# Altium schematic sheet LMD18200直流电机驱动器.SchDoc
size A4
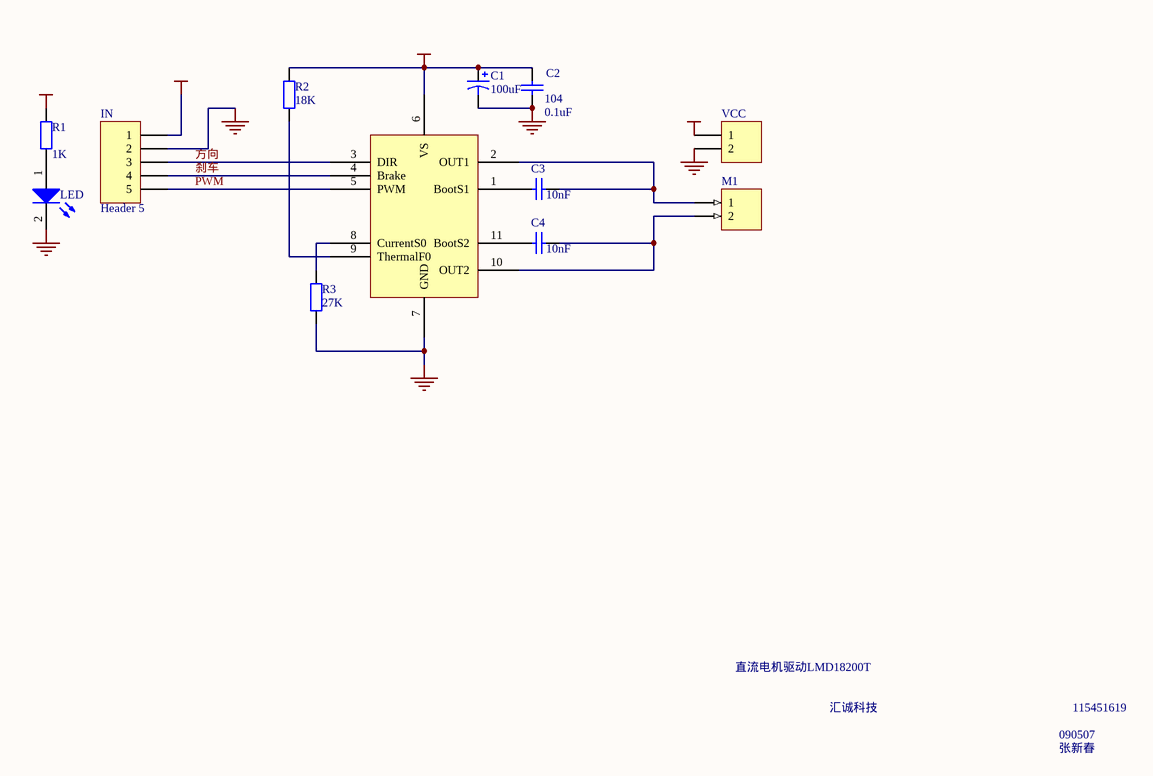
[diagram p0: LMD18200直流电机驱动器.SchDoc]

## Parts
?  (no value)  [LMD18200]
C1  value 100uF  [C-DJ-6]
C2  104  value 0.1uF  [CPDR]
C3  value 10nF  [CPDR]  (hidden comment: 104)
C4  value 10nF  [CPDR]  (hidden comment: 104)
DS1  LED  [LED_D]
IN  Header 5  [HDR1X5]
M1  (no value)  [JK128_2]
R1  value 1K  [RSE]  (hidden comment: Res)
R2  value 18K  [RSE]
R3  value 27K  [RSE]
VCC  (no value)  [JK128_2]

## Nets
+5V: IN.1 R1.2
GND: ?.7(GND) C1.2 C2.1 DS1.2(K) IN.2 R3.1 VCC.2
VCC: ?.6(VS) C1.1 C2.2 R2.2 VCC.1
PWM: ?.5(PWM) IN.5
刹车: ?.4(Brake) IN.4
方向: ?.3(DIR) IN.3
Net?_1: ?.1(BootS1) C3.2
Net?_2: ?.2(OUT1) C3.1 M1.1
Net?_8: ?.8(CurrentS0) R3.2
Net?_9: ?.9(ThermalF0) R2.1
Net?_10: ?.10(OUT2) C4.1 M1.2
Net?_11: ?.11(BootS2) C4.2
NetDS1_1: DS1.1(A) R1.1

## Notes on the sheet
- 直流电机驱动LMD18200T
- 汇诚科技
- 090507
- 115451619
- 张新春

## Library data of the parts
? = LMD18200
C1 = Cap Pol3: Polarized Capacitor (Surface Mount); Published: 8-Jun-2000; LatestRevisionDate: 17-Jul-2002; LatestRevisionNote: Re-released for DXP Platform.; PackageReference: C0805; Publisher: Altium Limited
C2-C4 = Cap: Capacitor; Published: 8-Jun-2000; LatestRevisionDate: 17-Jul-2002; LatestRevisionNote: Re-released for DXP Platform.; Publisher: Altium Limited
DS1 = LED: 发光二极管; Published: 8-Jun-2000; LatestRevisionDate: 17-Jul-2002; LatestRevisionNote: Re-released for DXP Platform.; Publisher: Altium Limited
IN = Header 5: Header, 5-Pin; LatestRevisionDate: 17-Jul-2002; LatestRevisionNote: Re-released for DXP Platform.; Publisher: Altium Limited
M1 VCC = MHDR1X2: Header, 2-Pin; LatestRevisionDate: 17-Jul-2002; LatestRevisionNote: Re-released for DXP Platform.; Publisher: Altium Limited
R1 = Res: 电阻; Published: 8-Jun-2000; LatestRevisionDate: 17-Jul-2002; LatestRevisionNote: Re-released for DXP Platform.; Publisher: Altium Limited
R2 R3 = Res2: Resistor; Published: 8-Jun-2000; LatestRevisionDate: 17-Jul-2002; LatestRevisionNote: Re-released for DXP Platform.; Publisher: Altium Limited